# EAGLE design esp32B-2A (EAGLE 7.5.0)
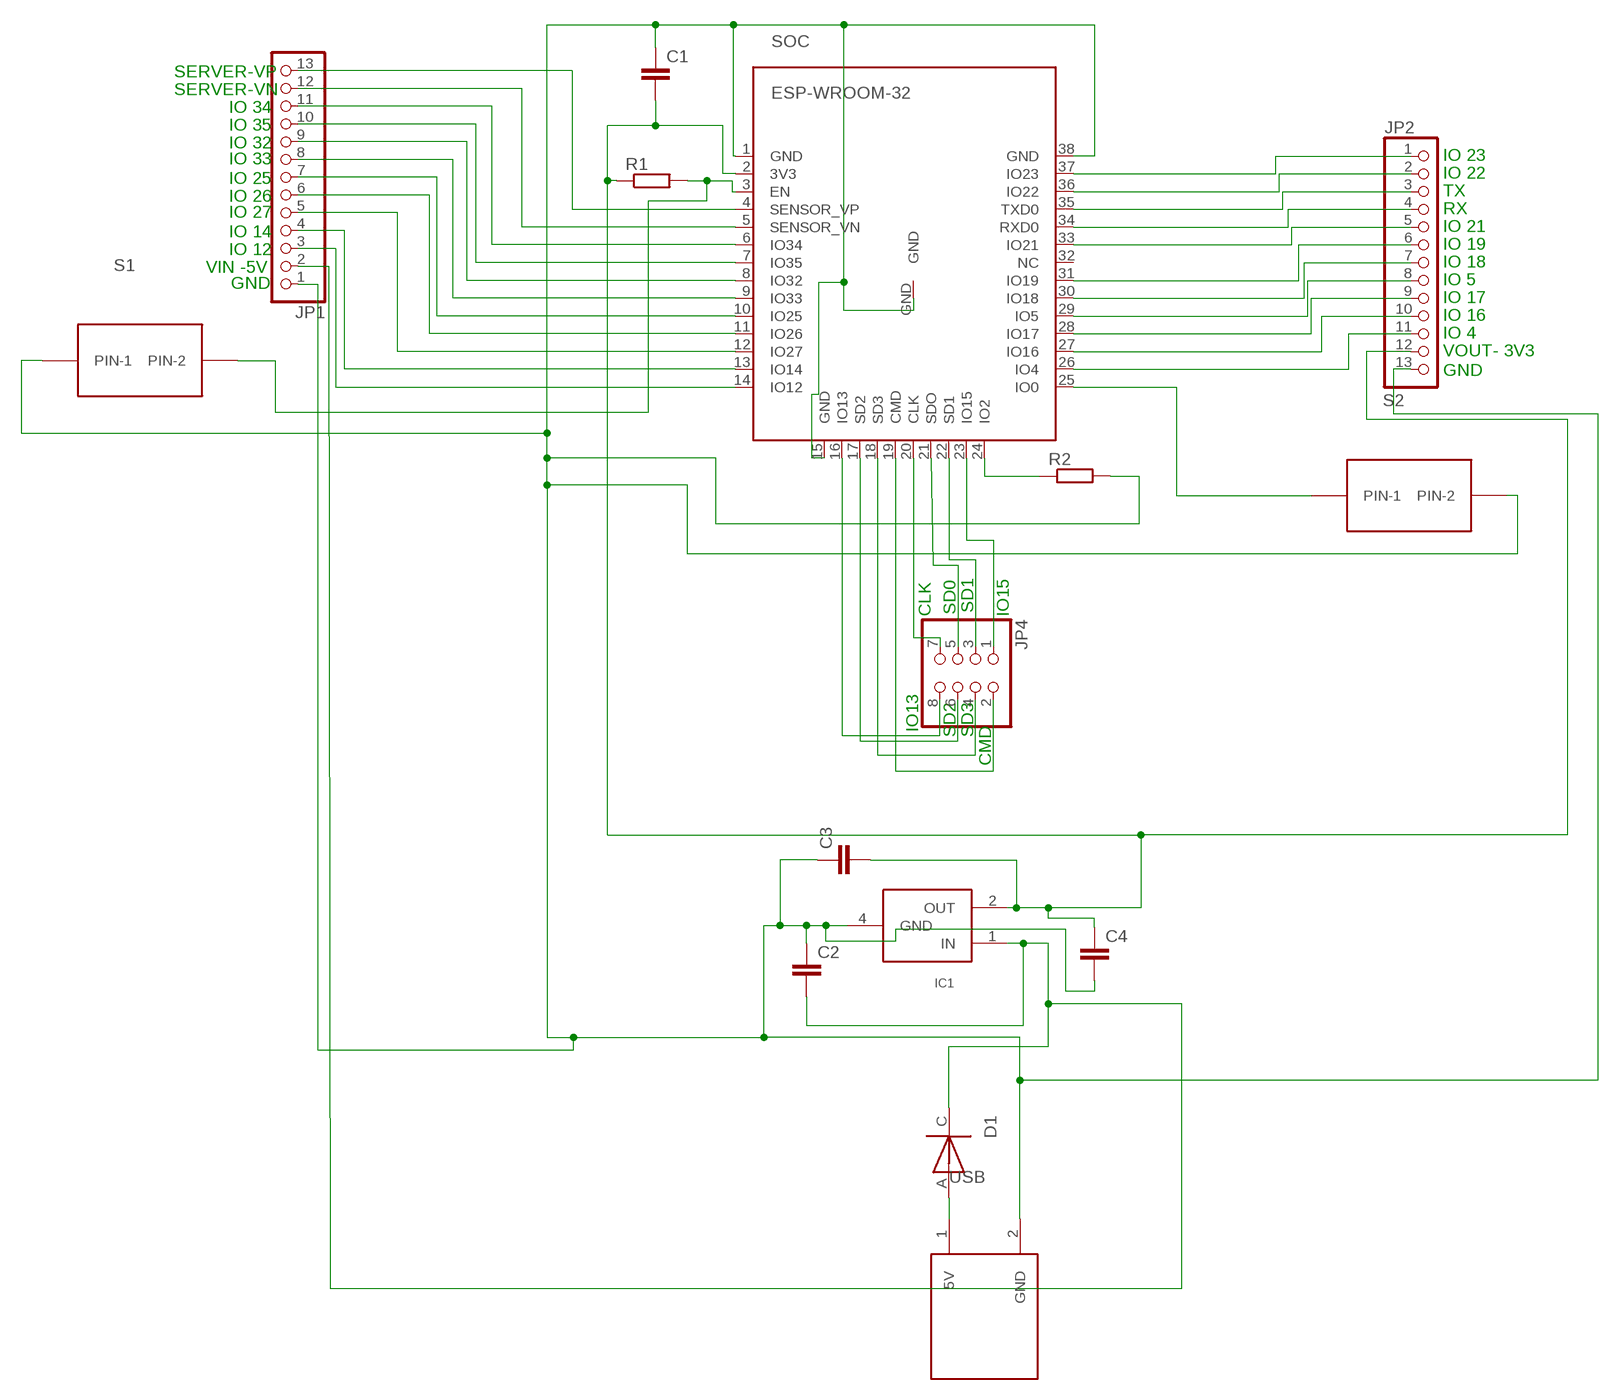
[diagram p0: schematic, sheet 1]

## Parts
C1  C-EUC0603  [C0603]
C2  C-EUC0603  [C0603]
C3  C-EUC1206  [C1206]
C4  C-EUC1206  [C1206]
D1  DIODE-EX  [SOD80C]
IC1  NJM2845DL1  [NJM2845DL1-PKG]
JP1  PINHD-1X13  [1X13]
JP2  PINHD-1X13  [1X13]
JP4  PINHD-2X4  [2X04]
R1  R-EU_R0603  [R0603]
R2  R-EU_R0603  [R0603]
S1  BTN2-EX  [B3F-10XX]
S2  BTN2-EX  [B3F-10XX]
SOC  ESP-WROOM-32  [ESP-WROOM-32]
USB  USB-CUST-1  [USB-CUST-1-PKG]

## Nets
N$1: JP2.2 SOC.36(IO22)
N$2: S2.1(PIN-1) SOC.25(IO0)
N$3: R2.1 SOC.24(IO2)
N$5: JP2.3 SOC.35(TXD0)
N$6: JP2.4 SOC.34(RXD0)
N$7: JP1.13 SOC.4(SENSOR_VP)
N$8: JP2.1 SOC.37(IO23)
N$9: JP4.8 SOC.16(IO13)
N$10: JP4.7 SOC.20(CLK)
N$11: JP2.5 SOC.33(IO21)
N$12: C1.2 C3.2 C4.1 IC1.2(OUT) JP2.12 R1.1 SOC.2(3V3)
N$14: D1.A USB.1(5V)
N$15: JP2.6 SOC.31(IO19)
N$16: JP2.7 SOC.30(IO18)
N$17: JP2.8 SOC.29(IO5)
N$18: JP2.9 SOC.28(IO17)
N$19: JP2.10 SOC.27(IO16)
N$20: JP2.11 SOC.26(IO4)
N$21: JP1.12 SOC.5(SENSOR_VN)
N$22: JP1.11 SOC.6(IO34)
N$23: JP1.10 SOC.7(IO35)
N$24: JP1.9 SOC.8(IO32)
N$25: JP1.8 SOC.9(IO33)
N$26: JP1.7 SOC.10(IO25)
N$27: JP1.6 SOC.11(IO26)
N$28: JP1.5 SOC.12(IO27)
N$29: JP4.5 SOC.21(SDO)
N$30: JP4.3 SOC.22(SD1)
N$32: JP4.2 SOC.19(CMD)
N$33: JP4.4 SOC.18(SD3)
N$34: JP4.6 SOC.17(SD2)
N$35: JP1.4 SOC.13(IO14)
N$36: JP1.3 SOC.14(IO12)
N$37: C1.1 C2.1 C3.1 C4.2 IC1.4(GND) JP1.1 JP2.13 R2.2 S1.1(PIN-1) S2.2(PIN-2) SOC.1(GND) SOC.15(GND) SOC.38(GND) SOC.GND USB.2(GND)
N$38: C2.2 D1.C IC1.1(IN) JP1.2
N$40: R1.2 S1.2(PIN-2) SOC.3(EN)
N$41: JP4.1 SOC.23(IO15)
Unconnected: SOC.32(NC)

## Notes on the sheet
- SERVER-VP
- SERVER-VN
- IO 34
- IO 35
- IO 32
- IO 33 | IO 23
- IO 22
- IO 25
- TX
- IO 26
- IO 27 | RX
- IO 21
- IO 14
- IO 19
- IO 12
- IO 18
- VIN -5V
- GND | IO 5
- IO 17
- IO 16
- IO 4
- VOUT- 3V3
- GND
- CLK | SD0 | SD1 | IO15
- IO13
- SD2 | SD3
- CMD

## Library data of the parts
C1-C4 = resistor:C-EU: CAPACITOR, European symbol
D1 = diode-ex2:DIODE-EX
IC1 = ic-NJM2391:NJM2845DL1
JP1 JP2 = pinhead:PINHD-1X13: PIN HEADER
JP4 = pinhead:PINHD-2X4: PIN HEADER
R1 R2 = resistor:R-EU_: RESISTOR, European symbol
S1 S2 = btn2-ex2:BTN2-EX
SOC = esp32-ex:ESP-WROOM-32
USB = usb-cust-2:USB-CUST-1

## Board
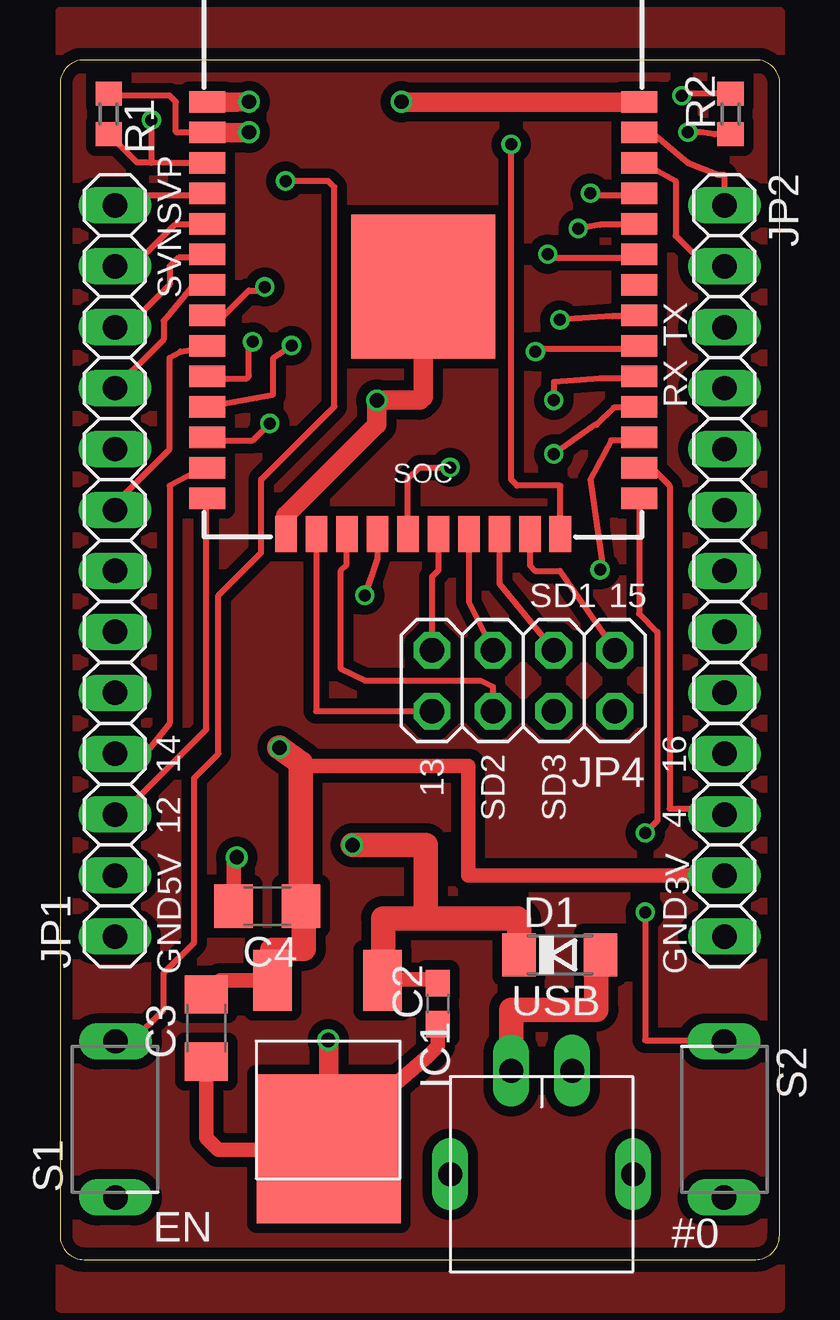
[diagram p1: board, top side]
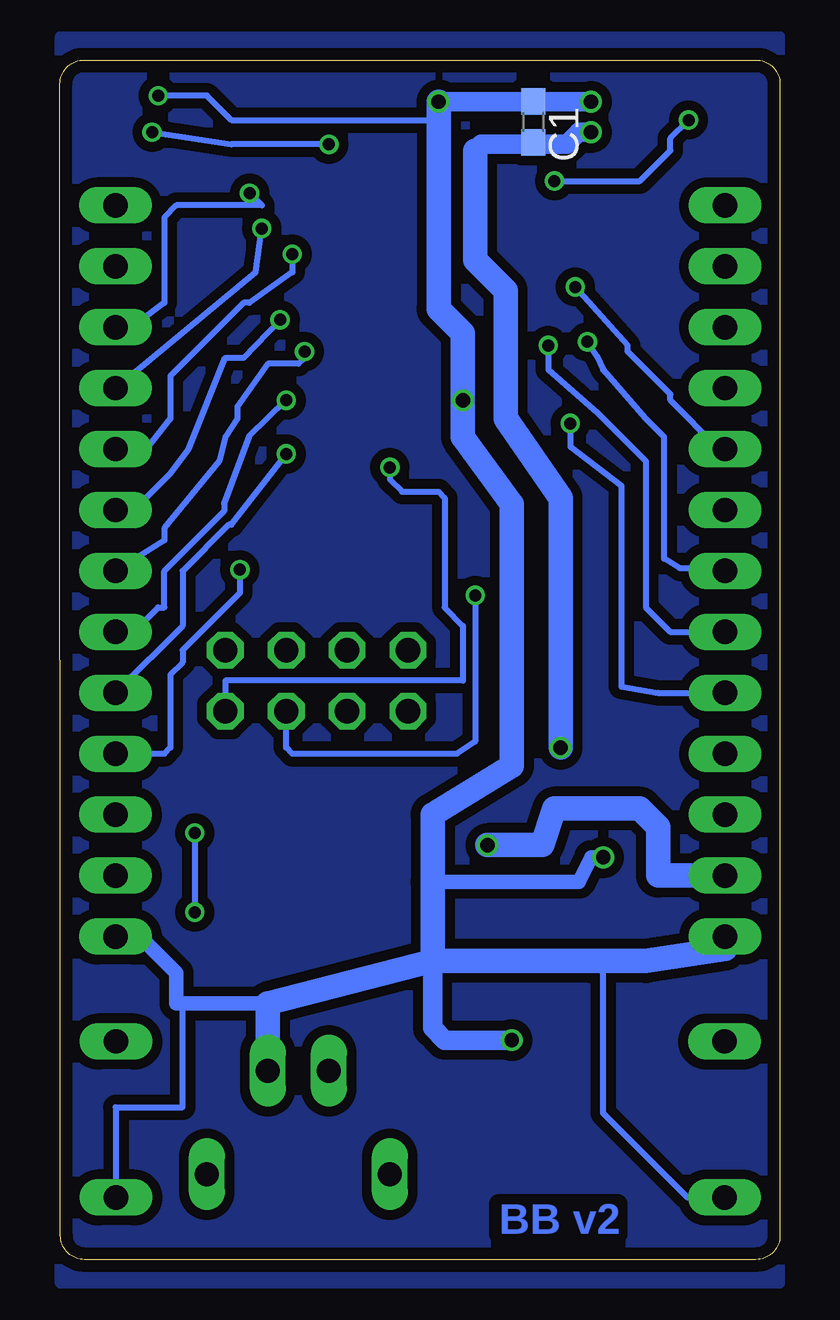
[diagram p2: board, bottom side, seen from below]

Size 30 x 50 mm. Coordinates in mm from the lower left corner, seen from the top.
Outline: 29.98,1 30,49 arc90 29,50 1,50 arc90 0,49 0,1 arc90 1,0 28.98,0 arc90 29.98,1
Copper layers (1*16): Top 0.035mm / dielectric 1.6mm / Bottom 0.035mm
Design rules "Elecrow_2-layer_PCB_eagle_rule": minimum track width 6mil, minimum drill 12mil, track to track 6mil, track to pad 6mil, pad to pad 6mil, via to via 8mil, smd to smd 0mil, copper to edge 20mil, drill to drill 10mil, minimum pad ring 6mil, minimum via ring 6mil, stop-mask expansion 0mil, vias tented up to drill 100mil, thermal gap 10mil

### Footprints (pad centres in the part's own frame; a part is rotated, then mirrored left to right if it is on the bottom)
C0603 = smd 1.1 x 1: 1 -0.85,0; 2 0.85,0
C1206 = smd 1.6 x 1.8: 1 -1.4,0; 2 1.4,0
SOD80C = smd 1.4 x 1.8: A 1.7,0; C -1.7,0
NJM2845DL1-PKG = smd 2.54 x 1.6: 1 -4.27,2.254; 2 -4.27,-2.318 | smd 6.2 x 6: 4 2.746,0.016
1X13 = drill 1.016 long: 1 -15.24,0; 2 -12.7,0; 3 -10.16,0; 4 -7.62,0; 5 -5.08,0; 6 -2.54,0; 7 0,0; 8 2.54,0; 9 5.08,0; 10 7.62,0; 11 10.16,0; 12 12.7,0; 13 15.24,0
2X04 = drill 1.016 octagon: 1 -3.81,-1.27; 2 -3.81,1.27; 3 -1.27,-1.27; 4 -1.27,1.27; 5 1.27,-1.27; 6 1.27,1.27; 7 3.81,-1.27; 8 3.81,1.27
R0603 = smd 1 x 1.1: 1 -0.85,0; 2 0.85,0
B3F-10XX = drill 1.016 long: 1 -3.251,1.499; 2 3.251,1.499
ESP-WROOM-32 = smd 0.9 x 1.5: 1 7.7,9; 2 6.43,9; 3 5.16,9; 4 3.89,9; 5 2.62,9; 6 1.35,9; 7 0.08,9; 8 -1.19,9; 9 -2.46,9; 10 -3.73,9; 11 -5,9; 12 -6.27,9; 13 -7.54,9; 14 -8.81,9; 25 -8.81,-9; 26 -7.54,-9; 27 -6.27,-9; 28 -5,-9; 29 -3.73,-9; 30 -2.46,-9; 31 -1.19,-9; 32 0.08,-9; 33 1.35,-9; 34 2.62,-9; 35 3.89,-9; 36 5.16,-9; 37 6.43,-9; 38 7.7,-9 | smd 1.5 x 0.9: 15 -10.3,5.715; 16 -10.3,4.445; 17 -10.3,3.175; 18 -10.3,1.905; 19 -10.3,0.635; 20 -10.3,-0.635; 21 -10.3,-1.905; 22 -10.3,-3.175; 23 -10.3,-4.445; 24 -10.3,-5.715 | smd 6 x 6: GND 0,0
USB-CUST-1-PKG = drill 1 long: 1 -1.27,6.604; 2 1.27,6.604; 3 -3.81,2.286; 4 3.81,2.286

### Placement (x,y rotation side)
C1  10.29,47.42 270 bottom
C2  15.75,10.67 90 top
C3  6.1,9.65 90 top
C4  8.64,14.73 180 top
D1  20.83,12.7 0 top
IC1  11.18,7.37 270 top
JP1  2.29,28.7 90 top
JP2  27.69,28.7 270 top
JP4  19.3,24.13 180 top
R1  2.03,47.75 270 top
R2  27.94,47.75 90 top
S1  3.81,5.84 90 top
S2  26.16,5.84 270 top
SOC  15.13,40.55 90 top
USB  20.07,1.27 0 top

### Tracks (layer width: path | path; a pad name or v marks a point on that pad's centre or on a via)
N$1
  Top 0.152: 24.18,45.62 SOC.36 24.23,45.57 24.54,45.57 | 27.58,41.45 JP2.2
  Top 0.254: 24.54,45.57 25.65,44.96 25.65,42.67 26.92,41.4 JP2.2
N$2  (via drill 0.5)
  Top 0.254: SOC.25 24.13,26.92 24.89,26.16 24.89,18.29 v24.38,17.78 | v24.38,14.48 24.38,9.14 27.2,9.14 S2.1
  Bottom 0.254: v24.38,17.78 v24.38,14.48
N$3  (via drill 0.5)
  Top 0.254: R2.1 27.27,46.9 26.67,46.99 v26.16,46.99 | SOC.24 20.84,32.24 20.83,32.26 19.05,32.26 18.8,32.51 v18.8,46.48
  Bottom 0.254: v18.8,46.48 22.86,46.48 v26.16,46.99
N$5  (via drill 0.5)
  Top 0.152: 24.54,44.35 24.23,44.35 SOC.35
  Top 0.254: 24.54,44.35 22.2,44.35 v22.1,44.45
  Bottom 0.254: v22.1,44.45 21.59,43.94 25.15,43.94 25.65,43.43 25.65,39.88 26.67,39.12 26.92,38.86 JP2.3
N$6  (via drill 0.5)
  Top 0.152: 23.77,43.13 24.08,43.13 SOC.34
  Top 0.254: 23.77,43.13 22.5,43.13 v21.59,42.98
  Bottom 0.254: v21.59,42.98 21.84,41.15 JP2.4
N$7
  Top 0.152: 6.1,44.35 SOC.4 | 2.29,44.04 JP1.13
  Top 0.254: 6.1,44.35 2.69,44.35 JP1.13
N$8
  Top 0.152: 24.69,46.94 24.23,46.94 SOC.37
  Top 0.254: 24.69,46.94 26.16,45.72 27.43,45.21 27.69,45.21 JP2.1
N$9
  Top 0.254: SOC.16 10.69,23.89 10.67,22.86 JP4.8
N$10
  Top 0.254: SOC.20 15.77,28.72 15.49,28.45 JP4.7
N$11  (via drill 0.5)
  Top 0.152: 24.54,41.76 24.23,41.76 SOC.33
  Top 0.254: v20.32,41.91 20.47,41.76 23.99,41.76 SOC.33
  Bottom 0.254: v20.32,41.91 20.32,41.15 22.1,39.88 22.35,39.88 25.4,36.83 25.4,35.05 26.42,33.78 JP2.5
N$12  (via drill 0.6)
  Top 0.254: 2.45,48.6 R1.1 2.12,48.51 4.57,48.51 4.83,48.26 4.83,46.99 6.12,46.99 SOC.2
  Top 0.61: JP2.12 17.02,16 17.02,20.57 10.04,20.57 | IC1.2 6.68,11.64 C3.2
  Top 0.813: SOC.2 7.86,46.98 v7.87,46.99
  Top 1.016: IC1.2 8.84,12.91 10.16,12.95 10.16,14.61 C4.1 10.04,20.57 10.04,20.7 v9.14,21.34
  Bottom 0.813: C1.2 10.24,46.57 | v7.87,46.99 8.38,46.99 8.89,46.48 10.2,46.48 C1.2 | 12.7,46.23 12.45,46.48 10.37,46.48 C1.2
  Bottom 1.016: v9.14,21.34 9.14,31.75 11.43,35.05 11.43,40.39 12.7,41.66 12.7,46.23
N$14
  Top 1.016: USB.1 18.8,10.41 22.35,10.41 22.35,12.52 D1.A
N$15  (via drill 0.5)
  Top 0.152: 23.77,39.32 24.08,39.32 SOC.31
  Top 0.254: 23.77,39.32 23.01,39.32 v20.83,39.17
  Bottom 0.152: 27.58,31.24 JP2.6
  Bottom 0.254: 27.58,31.24 26.92,31.24 25.4,32.77 24.64,33.78 23.11,37.59 22.35,37.59 v20.83,39.17
N$16  (via drill 0.5)
  Top 0.152: 24.54,37.95 24.23,37.95 SOC.30
  Top 0.254: 24.54,37.95 19.91,37.95 v19.81,37.85
  Bottom 0.254: v19.81,37.85 19.81,37.59 20.07,37.34 21.34,37.34 22.61,35.56 22.61,35.05 23.11,34.29 23.37,33.27 25.65,30.48 25.65,29.97 JP2.7
N$17  (via drill 0.5)
  Top 0.152: 23.77,36.73 24.08,36.73 SOC.29
  Top 0.254: 23.77,36.73 22.5,36.73 20.57,36.58 v20.57,35.81
  Bottom 0.152: 27.58,26.21 JP2.8
  Bottom 0.254: 27.58,26.21 26.87,26.21 25.91,27.18 25.65,27.18 25.65,28.7 23.16,31.19 23.16,31.5 22.1,34.34 v20.57,35.81
N$18  (via drill 0.5)
  Top 0.152: 23.77,35.51 24.08,35.51 SOC.28
  Top 0.254: 23.77,35.51 23.06,35.51 22.35,34.8 22.3,34.8 v20.57,33.58
  Bottom 0.152: 27.58,23.62 JP2.9
  Bottom 0.254: 27.58,23.62 27.58,23.72 24.89,26.42 24.89,28.7 22.96,30.63 22.86,30.63 v20.57,33.58
N$19  (via drill 0.5)
  Top 0.152: 23.62,34.14 24.08,34.14 SOC.27
  Top 0.254: 23.62,34.14 22.96,34.14 22.1,32.51 22.61,28.85 v22.5,28.75
  Bottom 0.254: v22.5,28.75 22.5,27.79 24.89,25.4 24.89,24.89 25.4,24.38 25.4,21.34 25.65,21.08 JP2.10
N$20
  Top 0.152: 24.54,32.92 24.23,32.92 SOC.26 | 27.58,18.59 JP2.11
  Top 0.254: 24.54,32.92 24.74,32.92 25.4,32.26 25.4,18.8 26.42,18.8 26.67,18.54 JP2.11
N$21
  Top 0.152: 6.1,43.13 SOC.5 | 2.29,41.45 JP1.12
  Top 0.254: 6.1,43.13 4.78,43.13 3.05,41.4 JP1.12
N$22
  Top 0.152: 6.1,41.76 SOC.6
  Top 0.254: 6.1,41.76 4.93,41.76 4.57,41.4 4.57,40.64 2.79,38.86 JP1.11
N$23
  Top 0.152: 5.64,40.54 6.1,40.54 SOC.7 | 2.29,36.42 JP1.10
  Top 0.254: 5.64,40.54 5.49,40.54 4.32,39.12 4.32,38.35 JP1.10
N$24  (via drill 0.5)
  Top 0.152: 5.79,39.32 6.1,39.32 SOC.8
  Top 0.254: 5.79,39.32 6.81,39.32 7.87,40.39 8.43,40.39 v8.53,40.54
  Bottom 0.152: 2.29,33.83 JP1.9
  Bottom 0.254: 2.29,33.83 2.59,33.83 4.57,35.81 4.57,36.07 6.35,37.85 6.35,38.1 v8.53,40.54
N$25
  Top 0.152: 5.64,37.95 6.1,37.95 SOC.9
  Top 0.254: JP1.8 2.29,31.5 4.57,33.78 4.57,37.59 5.03,37.85 5.64,37.95
N$26  (via drill 0.5)
  Top 0.152: 5.74,36.78 6.04,36.78 SOC.10 5.79,36.73
  Top 0.254: 5.79,36.73 7.77,36.73 7.87,36.83 7.87,38.1 v8.03,38.25
  Bottom 0.152: 2.29,28.8 JP1.7
  Bottom 0.254: v8.03,38.25 7.62,37.64 7.37,37.08 5.59,35.05 4.83,34.29 4.83,29.21 4.17,28.8 2.29,28.8
N$27  (via drill 0.5)
  Top 0.254: SOC.11 8.88,36.05 8.89,37.59 v9.65,38.1
  Bottom 0.254: v9.65,38.1 9.65,37.08 7.62,35.31 5.59,33.27 5.59,27.18 4.57,26.16 JP1.6
N$28  (via drill 0.5)
  Top 0.152: 6.55,34.14 6.25,34.14 SOC.12
  Top 0.254: 6.55,34.14 8.03,34.14 v8.74,34.85
  Bottom 0.254: v8.74,34.85 8.74,33.88 6.6,32.26 6.6,23.88 5.08,23.62 JP1.5
N$29
  Top 0.254: SOC.21 17.04,27.41 JP4.5
N$30
  Top 0.254: SOC.22 18.3,28.18 JP4.3
N$31
  pour Bottom (isolate 0.406, no thermals): 0,51 0,-1 30,-1 30,51
N$32  (via drill 0.5)
  Top 0.254: SOC.19 14.49,32.53 14.99,33.02 v16.26,33.02
  Bottom 0.254: JP4.2 23.11,24.13 13.21,24.13 13.21,26.42 13.97,27.18 13.97,31.75 14.22,32 15.75,32 16.26,32.51 v16.26,33.02
N$33  (via drill 0.5)
  Top 0.254: SOC.18 13.22,29.23 v12.7,27.69
  Bottom 0.254: v12.7,27.69 12.7,21.59 13.46,21.08 20.32,21.08 20.57,21.34 JP4.4
N$34
  Top 0.254: JP4.6 18.03,23.88 17.53,24.13 12.7,24.13 11.7,24.62 11.7,28.72 11.94,28.96 11.94,30.23 SOC.17
N$35
  Top 0.152: 5.64,32.92 6.1,32.92 SOC.13 | 2.29,21.18 JP1.4
  Top 0.254: 5.64,32.92 5.64,32.82 4.57,32.26 4.57,22.35 3.56,21.08 JP1.4
N$36
  Top 0.152: 6.1,31.7 SOC.14 | 2.29,18.59 JP1.3
  Top 0.254: 2.29,18.59 2.59,18.59 6.1,22.1 6.1,31.7 SOC.14
N$37  (via drill 0.5, 0.6)
  Top 0.152: 11.19,8.87 11.28,9.14 v11.18,9.14
  Top 0.254: R2.2 26,48.6 v25.91,48.51
  Top 0.61: C4.2 7.24,16.63 v7.37,16.76 | 10.99,4.83 IC1.4 11.14,4.57 6.6,4.57 6.1,5.08 C3.1 | 11.19,5.33 11.68,5.33 15.37,8.51 15.75,8.89 C2.1
  Top 0.813: SOC.1 7.35,48.25 v7.87,48.26 | SOC.38 14.24,48.25 v14.22,48.26 | 11.19,8.87 11.19,5.33 IC1.4 | SOC.15 9.41,31 13.21,34.8 v13.21,35.81 14.99,35.81 15.13,35.96 SOC.GND
  Bottom 0.254: 14.22,47.5 22.86,47.5 23.88,48.51 v25.91,48.51 | S2.2 27.66,6.33 27.69,6.35 24.89,6.35 24.89,10.67 | S1.1 3.86,2.59 7.37,6.1 7.37,11.94 7.87,12.45
  Bottom 0.61: JP2.13 26.67,13.46 25.15,11.94 25.15,10.67 24.89,10.67 21.34,10.67 | v7.37,16.76 7.87,16.76 8.38,15.75 14.48,15.75
  Bottom 0.813: v7.87,48.26 C1.1 v14.22,48.27 | v11.18,9.14 13.97,9.14 14.48,9.65 14.48,12.45
  Bottom 1.016: v14.22,48.27 v14.22,48.26 14.22,47.5 14.22,39.62 13.21,38.61 v13.21,35.81 13.21,34.29 11.18,31.5 11.18,20.57 14.48,18.54 14.48,15.75 14.48,12.45 | 14.48,12.45 21.34,10.67 USB.2 | JP1.1 2.29,12.95 5.59,12.45 7.87,12.45 14.48,12.45
N$38  (via drill 0.6)
  Top 0.61: 13.46,11.67 15.89,11.67 arc-45 C2.2
  Top 1.016: D1.C 19.13,14.15 19.05,14.22 15.24,14.22 | 15.24,14.22 13.46,14.22 13.46,11.67 IC1.1 | v12.19,17.27 15.24,17.27 15.24,14.22
  Bottom 1.016: JP1.2 5.08,16 5.08,18.03 5.84,18.8 9.4,18.8 9.91,17.27 v12.19,17.27
N$39
  pour Top (isolate 0.406, no thermals): 0,52 0,-2 30,-2 30,52
N$40  (via drill 0.5)
  Top 0.254: SOC.3 4.59,45.71 3.8,45.72 | 3.8,45.72 3.56,45.72 3.21,45.72 R1.2 2.2,46.74 | S1.2 3,9.09 4.32,10.41 4.32,11.94 5.59,13.21 5.59,20.07 6.6,21.08 6.6,27.69 8.38,29.46 8.38,32.51 11.43,35.56 11.43,44.7 11.18,44.96 v9.4,44.96 | v3.81,47.5 3.81,45.72 3.8,45.72
  Bottom 0.254: v9.4,44.96 5.84,44.96 4.57,46.23 4.57,46.74 v3.81,47.5
N$41
  Top 0.254: SOC.23 19.57,28.94 19.81,28.7 20.83,28.7 JP4.1

### Text on the board
Bottom: BB v2
tNames: SVP | SVN | TX | RX | SD1 | 15 | 14 | 16 | 13 | 12 | SD2 | SD3 | 4 | 5V | 3V | GND | GND | EN | #0